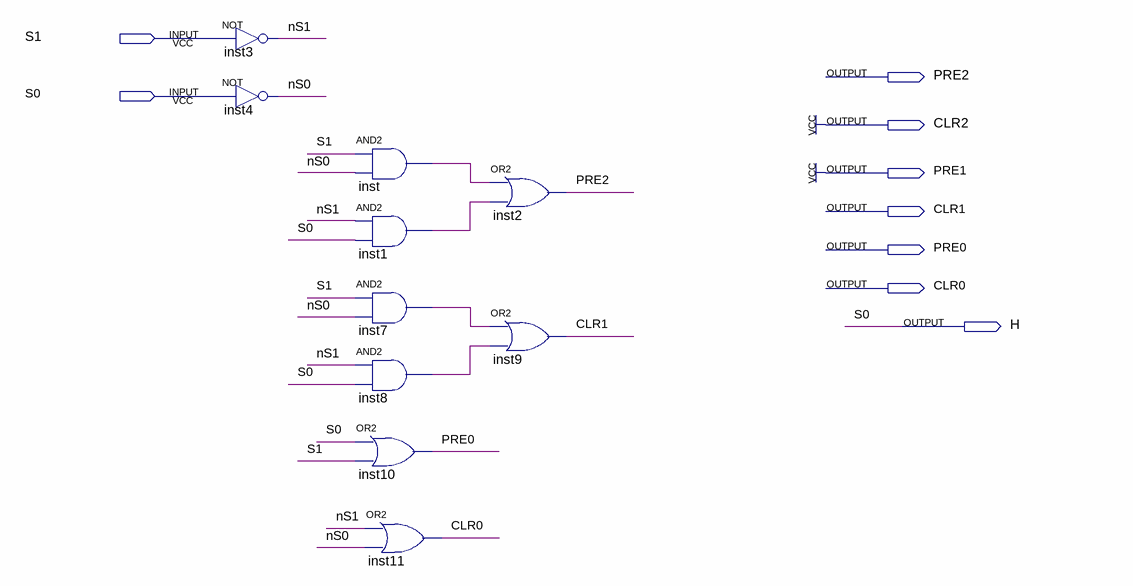
[diagram p0: schematic sheet]
// Quartus schematic LogicadeSelecao.bdf as structural Verilog: 10 symbols, 9 pins
module LogicadeSelecao (
  input  S1,
  input  S0,
  output PRE2,
  output CLR2,
  output PRE1,
  output CLR1,
  output PRE0,
  output CLR0,
  output H
);

  wire inst1_out, inst7_out, inst8_out, inst_out, nS0, nS1;

  not inst3 (nS1, S1);
  not inst4 (nS0, S0);
  and inst (inst_out, S1, nS0);
  and inst1 (inst1_out, nS1, S0);
  and inst7 (inst7_out, S1, nS0);
  and inst8 (inst8_out, nS1, S0);
  or inst10 (PRE0, S0, S1);
  or inst11 (CLR0, nS1, nS0);
  or inst2 (PRE2, inst_out, inst1_out);
  or inst9 (CLR1, inst7_out, inst8_out);

  assign CLR2 = 1'b1;
  assign H = S0;
  assign PRE1 = 1'b1;
endmodule
